# Altium schematic sheet 枪盒设置板-20201219.SchDoc
size A4
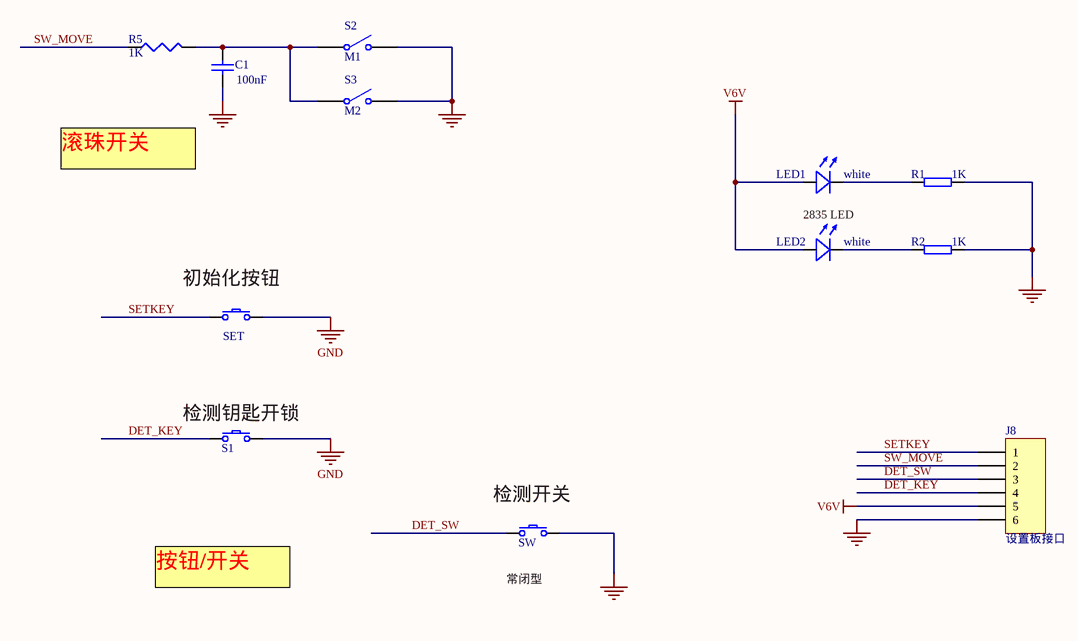
[diagram p0: 枪盒设置板-20201219.SchDoc]

## Parts
C1  100nF  [0603C]
J8  设置板接口  [6P-1mm]
LED1  white  [2835LED]
LED2  white  [2835LED]
R1  1K  [0603R]
R2  1K  [0603R]
R5  1K  [0603R]
S1  SW  [SW-TH_TC-5610H-T]  (value not drawn)
S2  M1  [滚珠开关]
S3  M2  [滚珠开关]
SET  SW  [KEY_5.2*3.7*6.4]  (value not drawn)
SW  SW  [轻触开关]  (value not drawn)

## Nets
GND: C1.1 J8.6 R1.2 R2.2 S1.1 S2.2(NO) S3.2(NO) SET.2 SW.2
V6V: J8.5 LED1.2 LED2.2
DET_KEY: J8.4 S1.2
DET_SW: J8.3 SW.1
SETKEY: J8.1 SET.1
SW_MOVE: J8.2 R5.1
NetC1_2: C1.2 R5.2 S2.1(COMMON) S3.1(COMMON)
NetLED1_1: LED1.1 R1.1
NetLED2_1: LED2.1 R2.1

## Notes on the sheet
- 滚珠开关
- 2835 LED
- (near SET) 初始化按钮
- (near S1) 检测钥匙开锁
- (near SW) 检测开关
- 按钮/开关
- (near SW) 常闭型

## Library data of the parts
C1 = Cap: 100nF/6.3V X5R ±20%; Value: 1uf; Published: 8-Jun-2000; LatestRevisionDate: 17-Jul-2002; LatestRevisionNote: Re-released for DXP Platform.; PackageReference: RAD-0.3; Publisher: Altium Limited; PackageDescription: Radial Cap, Thru-Hole; 2 Leads; 0.3 in Pin Spacing
J8 = Header 6: Header, 6-Pin; LatestRevisionDate: 17-Jul-2002; LatestRevisionNote: Re-released for DXP Platform.; Publisher: Altium Limited
LED1 LED2 = LED
R1 R2 R5 = R
S1 SET SW = SW: Switch
S2 S3 = SW-SPST: Single-Pole, Single-Throw Switch; Published: 24-Mar-1999; LatestRevisionDate: 17-Jul-2002; LatestRevisionNote: Re-released for DXP Platform.; PackageReference: SPST-2; Publisher: Altium Limited